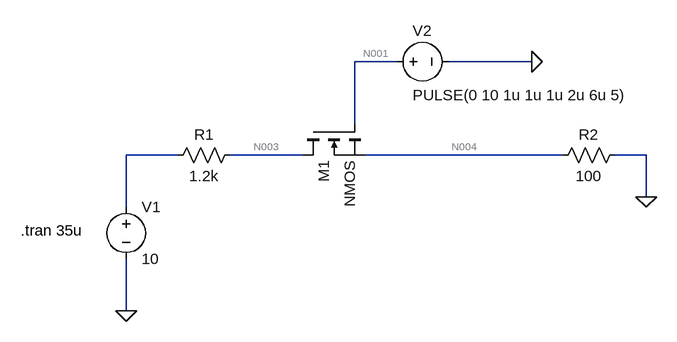
[diagram p0: schematic MOSFET.asc]
MOSFET.asc, the LTspice schematic file:
Version 4
SHEET 1 880 680
WIRE 464 -80 400 -80
WIRE 672 -80 544 -80
WIRE 400 16 400 -80
WIRE 128 64 48 64
WIRE 320 64 208 64
WIRE 720 64 416 64
WIRE 848 64 800 64
WIRE 848 128 848 64
WIRE 48 144 48 64
WIRE 48 304 48 224
FLAG 848 128 0
FLAG 672 -80 0
FLAG 48 304 0
SYMBOL voltage 48 128 R0
WINDOW 123 0 0 Left 0
WINDOW 39 0 0 Left 0
SYMATTR InstName V1
SYMATTR Value 10
SYMBOL voltage 448 -80 R270
WINDOW 0 32 56 VTop 2
WINDOW 3 -36 206 VBottom 2
WINDOW 123 0 0 Left 0
WINDOW 39 0 0 Left 0
SYMATTR InstName V2
SYMATTR Value PULSE(0 10 1u 1u 1u 2u 6u 5)
SYMBOL nmos 320 16 M90
SYMATTR InstName M1
SYMBOL res 224 48 R90
WINDOW 0 0 56 VBottom 2
WINDOW 3 32 56 VTop 2
SYMATTR InstName R1
SYMATTR Value 1.2k
SYMBOL res 816 48 R90
WINDOW 0 0 56 VBottom 2
WINDOW 3 32 56 VTop 2
SYMATTR InstName R2
SYMATTR Value 100
TEXT -114 180 Left 2 !.tran 35u

The netlist it stands for:
* MOSFET.asc
V1 N002 0 10
V2 N001 0 PULSE(0 10 1u 1u 1u 2u 6u 5)
M1 N003 N001 N004 N004 NMOS
R1 N003 N002 1.2k
R2 0 N004 100
.model NMOS NMOS
.model PMOS PMOS
.lib standard.mos
.tran 35u
.backanno
.end

* Results of the author's LTspice run, read from the files saved beside the schematic
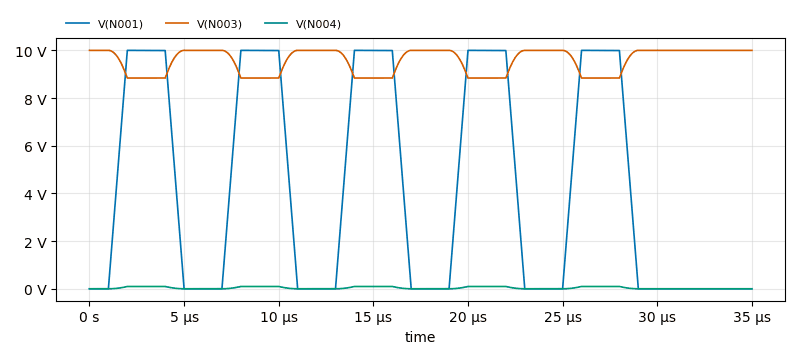
[diagram p1: Transient Analysis of MOSFET.asc, plotted from the saved traces]
* Transient Analysis, 1 run:
*   V(N001): min 0 V, max 10 V, average 4.285 V, rms 6.172 V, last 0 V
*   V(N003): min 8.839 V, max 10 V, average 9.556 V, rms 9.57 V, last 10 V
*   V(N004): min 0 V, max 96.73 mV, average 37.01 mV, rms 56.8 mV, last 0 V